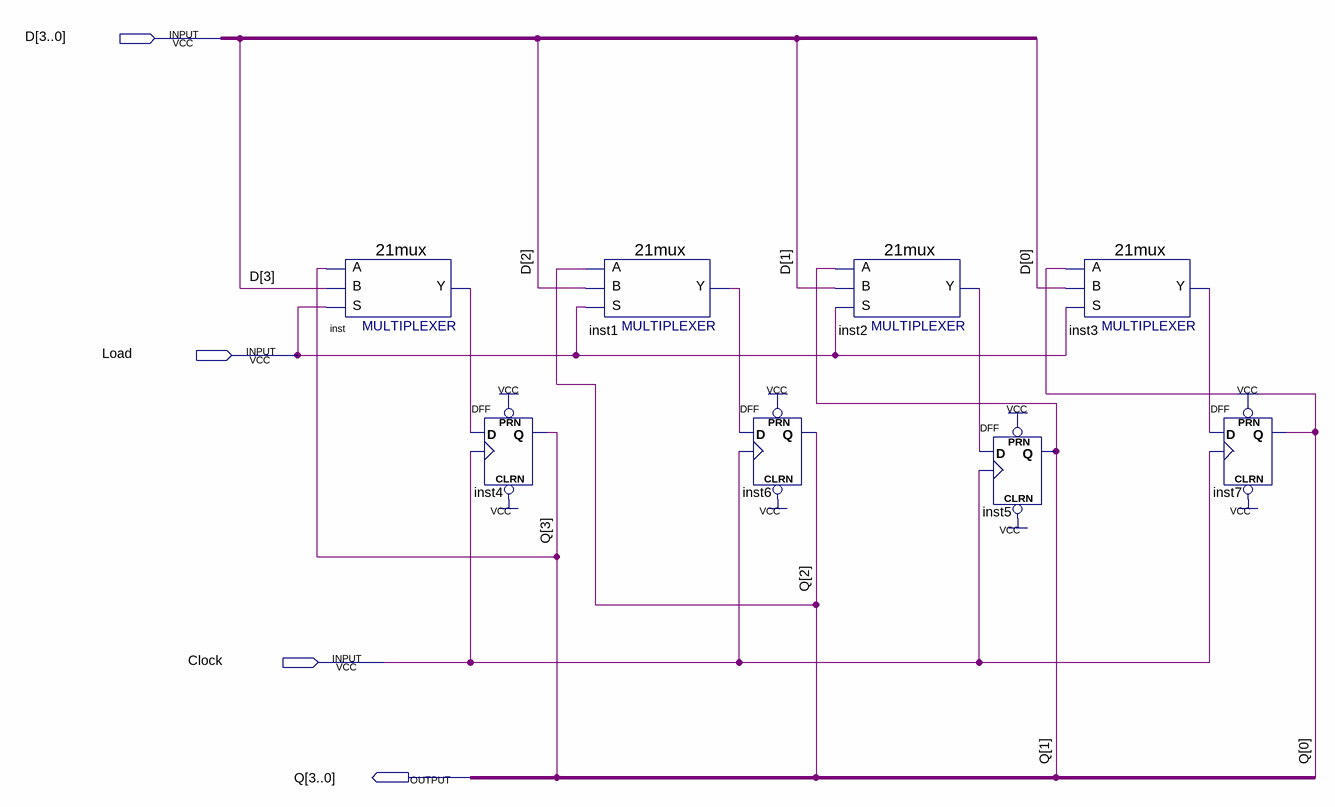
[diagram p0: schematic sheet]
// Quartus schematic 4wideshiftregister.bdf as structural Verilog: 8 symbols, 4 pins
module \4wideshiftregister  (
  input  [3:0] D,
  input  Load,
  input  Clock,
  output [3:0] Q
);

  wire inst1_y, inst2_y, inst3_y, inst_y;

  \21mux  inst (.S(Load), .B(D[3]), .A(Q[3]), .Y(inst_y));
  DFF inst4 (.CLRN(1'b1), .CLK(Clock), .D(inst_y), .PRN(1'b1), .Q(Q[3]));
  \21mux  inst1 (.S(Load), .B(D[2]), .A(Q[2]), .Y(inst1_y));
  DFF inst6 (.CLRN(1'b1), .CLK(Clock), .D(inst1_y), .PRN(1'b1), .Q(Q[2]));
  \21mux  inst2 (.S(Load), .B(D[1]), .A(Q[1]), .Y(inst2_y));
  DFF inst5 (.CLRN(1'b1), .CLK(Clock), .D(inst2_y), .PRN(1'b1), .Q(Q[1]));
  \21mux  inst3 (.S(Load), .B(D[0]), .A(Q[0]), .Y(inst3_y));
  DFF inst7 (.CLRN(1'b1), .CLK(Clock), .D(inst3_y), .PRN(1'b1), .Q(Q[0]));
endmodule
